# EAGLE design counter-defender-featherwing-mk-2.0 (EAGLE 7.5.0)
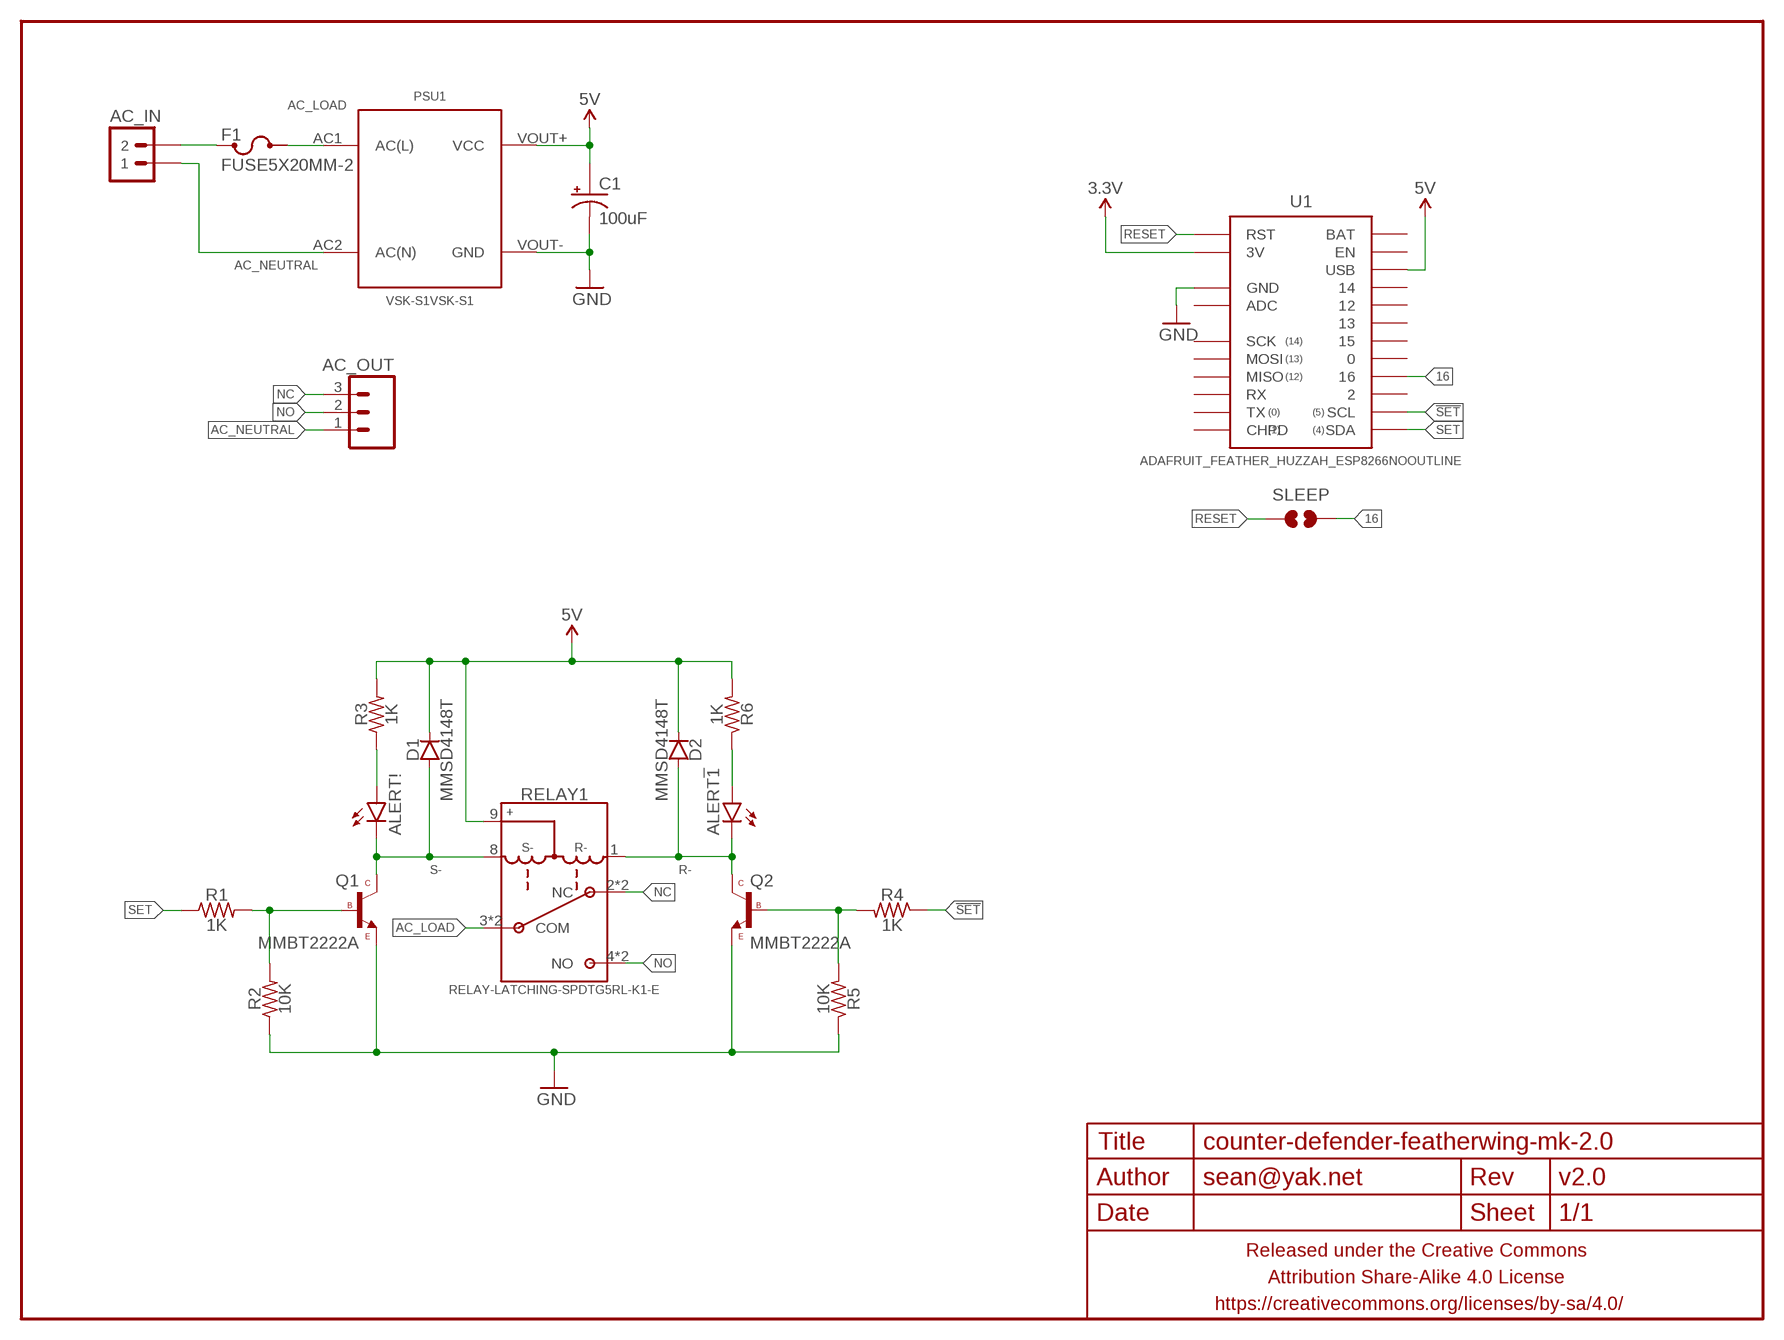
[diagram p0: schematic, sheet 1]

## Parts
AC_IN  M023.5MM  [SCREWTERMINAL-3.5MM-2]
AC_OUT  M03SCREW  [SCREWTERMINAL-3.5MM-3]
ALERT!  LED0603-TIGHT  [LED-0603-TIGHT]
ALERT!1  LED0603-TIGHT  [LED-0603-TIGHT]
C1  100uF  CAPACITOR-POLARIZEDE2.5-6  [E2,5-6]
D1  MMSD4148T  DIODESOD123  [SOD123]
D2  MMSD4148T  DIODESOD123  [SOD123]
F1  FUSE5X20MM-2  [FUSE-2AG]
FRAME1  FRAME-LETTERNO_PACKAGE  [DUMMY]
PSU1  VSK-S1VSK-S1  [VSK-S1]
Q1  MMBT2222A  TRANSISTOR_NPNMMBT2222A  [SOT23]
Q2  MMBT2222A  TRANSISTOR_NPNMMBT2222A  [SOT23]
R1  1K  RESISTORR0603-TIGHTER  [R0603-TIGHTER]
R2  10K  RESISTORR0603-TIGHTER  [R0603-TIGHTER]
R3  1K  RESISTORR0603-TIGHTER  [R0603-TIGHTER]
R4  1K  RESISTORR0603-TIGHTER  [R0603-TIGHTER]
R5  10K  RESISTORR0603-TIGHTER  [R0603-TIGHTER]
R6  1K  RESISTORR0603-TIGHTER  [R0603-TIGHTER]
RELAY1  RELAY-LATCHING-SPDTG5RL-K1-E  [G5RL-K1-E]
SLEEP  JUMPER-PAD-2-NOYES_SILK  [PAD-JUMPER-2-NO_YES_SILK]
U1  ADAFRUIT_FEATHER_HUZZAH_ESP8266NOOUTLINE  [ADAFRUIT_FEATHER_HUZZAH_NOOUTLINE]

## Nets
3.3V: U1.3V
5V: C1.+ D1.C D2.C PSU1.VOUT+(VCC) R3.2 R6.2 RELAY1.9(+) U1.USB
16: SLEEP.2 U1.16
!SET: R4.1 U1.SCL
AC_LOAD: F1.2 F1.2@2 PSU1.AC1(AC(L)) RELAY1.3(COM) RELAY1.6(COM)
AC_NEUTRAL: AC_IN.1 AC_OUT.1
GND: C1.- PSU1.VOUT-(GND) Q1.2(E) Q2.2(E) R2.1 R5.1 U1.GND@0(GND)
N$1: ALERT!.A R3.1
N$2: Q1.1(B) R1.2 R2.2
N$3: Q2.1(B) R4.2 R5.2
N$4: ALERT!1.A R6.1
N$6: AC_IN.2 F1.1 F1.1@1
NC: AC_OUT.3 RELAY1.2(NC) RELAY1.7(NC)
NO: AC_OUT.2 RELAY1.4(NO) RELAY1.5(NO)
R-: ALERT!1.C D2.A Q2.3(C) RELAY1.1(R-)
RESET: SLEEP.1 U1.RST
S-: ALERT!.C D1.A Q1.3(C) RELAY1.8(S-)
SET: R1.1 U1.SDA
Unconnected: PSU1.AC2(AC(N)) U1.0 U1.2 U1.12 U1.13 U1.14 U1.15 U1.ADC U1.BAT U1.CHPD U1.EN U1.MISO U1.MOSI U1.RX U1.SCK U1.TX

## Library data of the parts
AC_IN = a_parts:M02: Standard 2-pin 0.1" header. Use with - straight break away headers ( PRT-00116) - right angle break away headers (PRT-00553) - swiss pins (PRT-00743) - machine pins (PRT-00117) - female headers (PRT-00115) Molex polarized connector foot print use with: PRT-08233 with associated crimp pins and housings. 2.54_SCREWTERM for use with PRT-10571. 3.5mm Screw Terminal footprints for PRT-08084 5mm Screw Terminal footprints for use with PRT-08433
AC_OUT = a_parts:M03: Header 3 Standard 3-pin 0.1" header. Use with straight break away headers (SKU : PRT-00116), right angle break away headers (PRT-00553), swiss pins (PRT-00743), machine pins (PRT-00117), and female headers (PRT-00115). Molex polarized connector foot print use with SKU : PRT-08232 with associated crimp pins and housings.
ALERT! ALERT!1 = a_parts:LED: LEDs Standard schematic elements and footprints for 5mm, 3mm, 1206, and 0603 sized LEDs. 5mm - Spark Fun Electronics SKU : COM-00529 (and others)
C1 = a_parts:CAPACITOR-POLARIZED: POLARIZED CAPACITOR, American symbol
D1 D2 = a_parts:DIODE: Diode These are standard reverse protection diodes and small signal diodes. SMA package can handle up to about 1A. SOD-323 can handle about 200mA. What the SOD-323 package when ordering, there are some mfgs out there that are 5-pin packages.
F1 = a_parts:FUSE
FRAME1 = a_parts:FRAME-LETTER: Schematic Frame Standard 8.5x11 US Letter frame; DESIGNER: sean@yak.net; VERSION: v2.0
PSU1 = a_parts:VSK-S1: VSK-S1 is an AC/DC converter for PCB mounting.
Q1 Q2 = a_parts:TRANSISTOR_NPN: Generic NPN BJT MMBT2222A - TRANS-08049 (SOT-23, 1A 40V) MPSA42 - TRANS-09116 (SOT-23, 500mA 300V) MMBT5088LT1G - TRANS-11160 (SOT-23, 50 mA 30V) BC547 - COM-08928 <http://www.sparkfun.com/products/8928> (TO-92 45V 100mA) (1.Collector 2.Base 3.Emitter) 2N3904 - COM-00521 <http://www.sparkfun.com/products/521> (TO-92 40V 200mA) (1.Emitter 2.Base 3.Collector) P2N2222A - COM-12852 <http://www.sparkfun.com/products/12852> (TO-92 40V 600mA) (1.Collector 2.Base 3.Emitter)
R1-R6 = a_parts:RESISTOR: RESISTOR, American symbol
RELAY1 = a_parts:RELAY-LATCHING-SPDT
SLEEP = a_parts:JUMPER-PAD-2-NO
U1 = a_parts:ADAFRUIT_FEATHER_HUZZAH_ESP8266

## Board
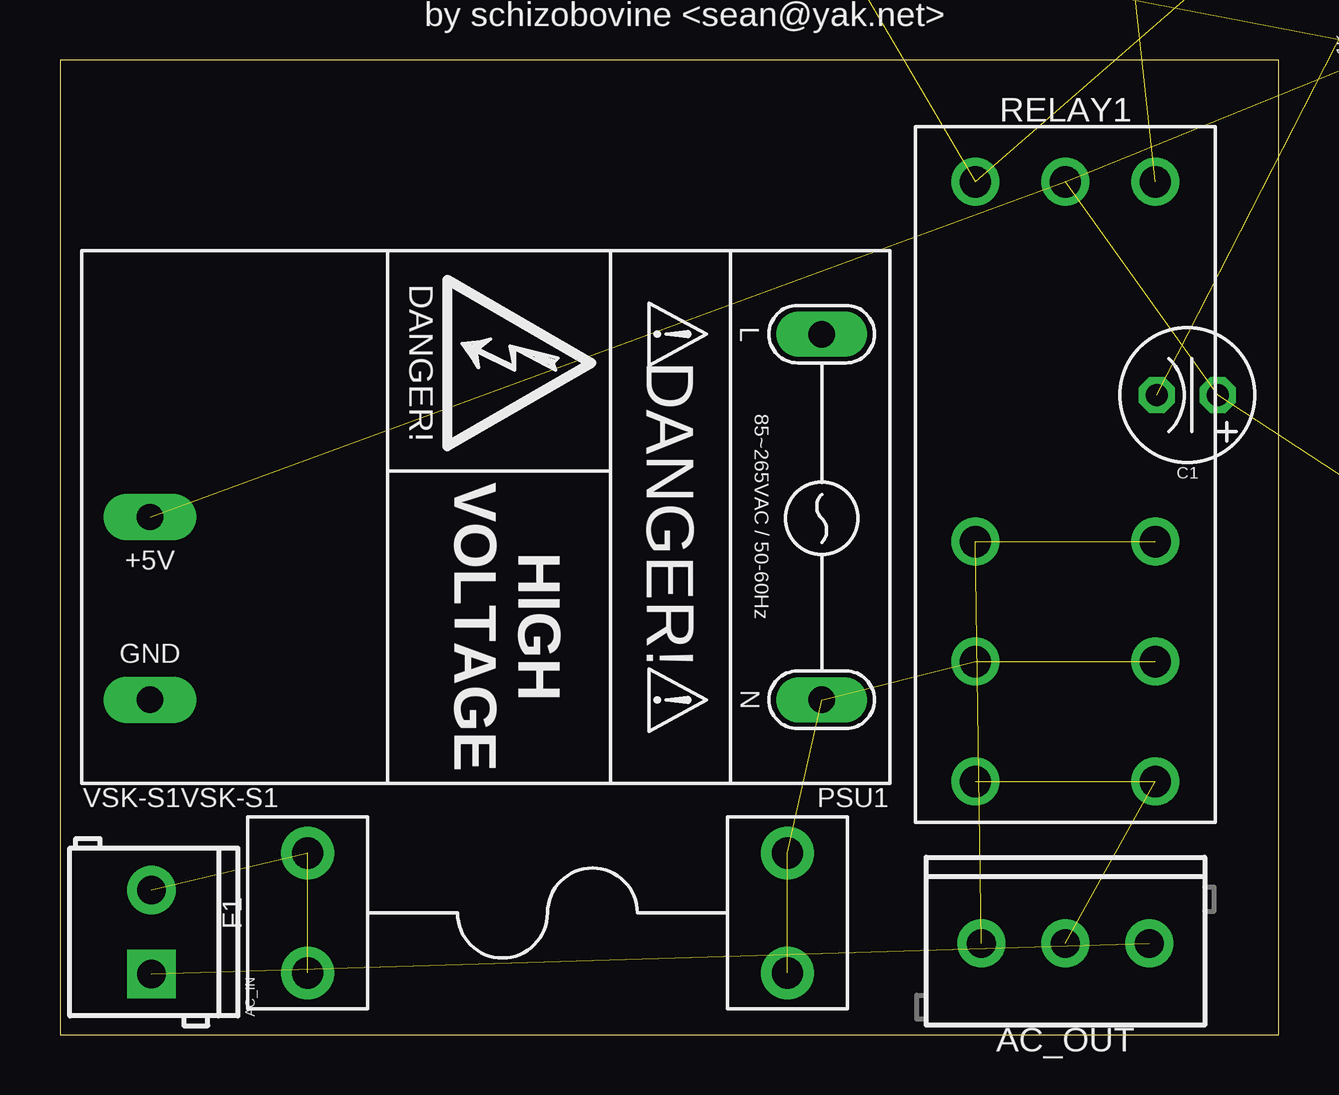
[diagram p1: board, top side]
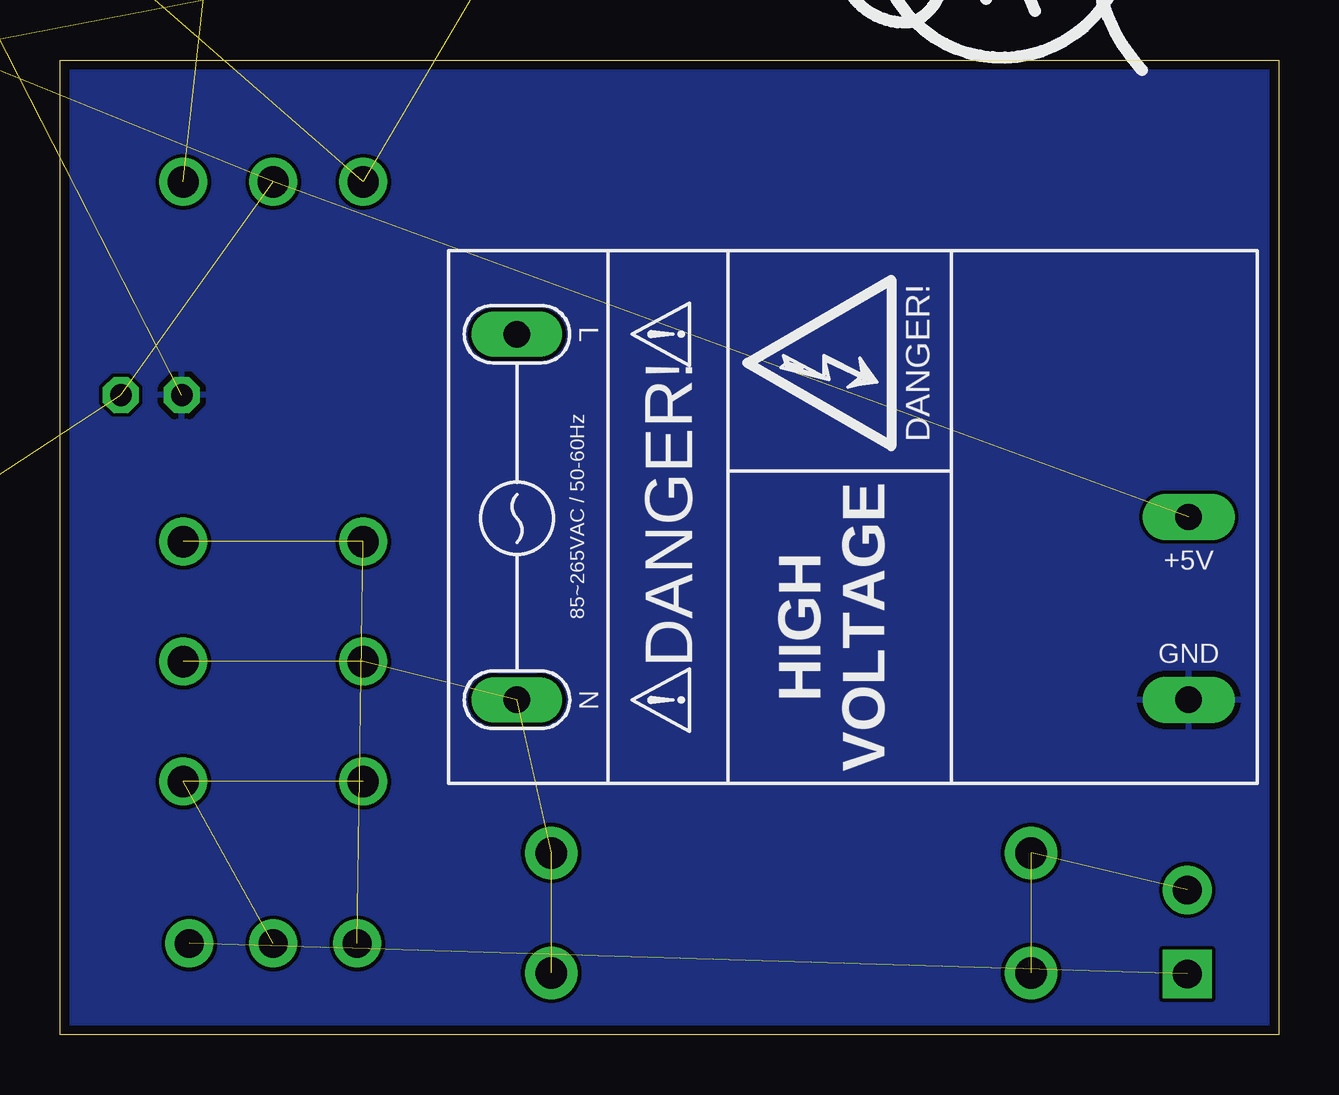
[diagram p2: board, bottom side, seen from below]

Size 50.8 x 40.64 mm. Coordinates in mm from the lower left corner, seen from the top.
Outline: 0,40.64 0,0 50.8,0 50.8,40.64 0,40.64
Copper layers (1*16): Top 0.0356mm / dielectric 1.5011mm / Bottom 0.0356mm
Design rules "LaenPCBOrder2": minimum track width 6mil, minimum drill 13mil, track to track 6mil, track to pad 6mil, pad to pad 6mil, via to via 6mil, smd to smd 6mil, copper to edge 15mil, drill to drill 6mil, minimum pad ring 7mil, minimum via ring 7mil, stop-mask expansion 3mil, vias tented up to drill 20mil, thermal gap 10mil

### Footprints (pad centres in the part's own frame; a part is rotated, then mirrored left to right if it is on the bottom)
SCREWTERMINAL-3.5MM-2 = drill 1.2 pad 2.032 square: 1 0,0 | drill 1.2 pad 2.032: 2 3.5,0
SCREWTERMINAL-3.5MM-3 = drill 1.2 pad 2: 1 -3.5,0; 2 0,0; 3 3.5,0
LED-0603-TIGHT = smd 0.8 x 1.1: A 0.75,0; C -0.75,0
E2,5-6 = drill 0.9 pad 1.5 octagon: + -1.27,0; - 1.27,0
SOD123 = smd 1.2 x 1: A -1.8,0; C 1.8,0
FUSE-2AG = drill 1.3 pad 2.2: 1 -10,2.5; 1@1 -10,-2.5; 2 10,2.5; 2@2 10,-2.5
VSK-S1 = drill 1.1 pad 1.9 long: AC1 0,15.24; AC2 0,0 | drill 1.1 pad 1.93 long: VOUT+ 28,7.62; VOUT- 28,15.24
SOT23 = smd 1 x 1.2: 1 -0.95,-1; 2 0.95,-1; 3 0,1
R0603-TIGHTER = smd 0.8 x 1.1: 1 -0.75,0; 2 0.75,0
G5RL-K1-E = drill 1.3 pad 2: 1 0,3.75; 2 15,3.75; 3 20,3.75; 4 25,3.75; 5 25,-3.75; 6 20,-3.75; 7 15,-3.75; 8 0,-3.75; 9 0,0
PAD-JUMPER-2-NO_YES_SILK = smd 0.635 x 1.27: 1 -0.45,0; 2 0.45,0
ADAFRUIT_FEATHER_HUZZAH_NOOUTLINE = drill 1 pad 1.5 octagon: 0 8.89,10.16; 2 13.97,10.16; 3V -16.51,-10.16; 12 1.27,10.16; 13 3.81,10.16; 14 -1.27,10.16; 15 6.35,10.16; 16 11.43,10.16; ADC -8.89,-10.16; BAT -8.89,10.16; CHPD 19.05,-10.16; EN -6.35,10.16; GND@0 -11.43,-10.16; MISO 11.43,-10.16; MOSI 8.89,-10.16; NC@3 -13.97,-10.16; NC@6 -6.35,-10.16; NC@7 -3.81,-10.16; NC@8 -1.27,-10.16; NC@9 1.27,-10.16; NC@10 3.81,-10.16; RST -19.05,-10.16; RX 13.97,-10.16; SCK 6.35,-10.16; SCL 16.51,10.16; SDA 19.05,10.16; TX 16.51,-10.16; USB -3.81,10.16

### Placement (x,y rotation side)
AC_IN  3.81,2.54 90 top
AC_OUT  41.91,3.81 180 top
ALERT!  25.4,47.62 270 top  (outside the outline)
ALERT!1  45.09,47.62 0 top  (outside the outline)
C1  46.99,26.67 180 top
D1  55.24,48.9 0 top  (outside the outline)
D2  64.77,48.9 0 top  (outside the outline)
F1  20.32,5.08 0 top
FRAME1  0,0 0 top
PSU1  31.75,29.21 180 top
Q1  30.48,47.62 0 top  (outside the outline)
Q2  39.37,47.62 0 top  (outside the outline)
R1  55.24,46.35 0 top  (outside the outline)
R2  55.24,43.81 0 top  (outside the outline)
R3  55.24,41.27 0 top  (outside the outline)
R4  64.14,45.09 0 top  (outside the outline)
R5  69.22,45.09 0 top  (outside the outline)
R6  64.14,42.55 0 top  (outside the outline)
RELAY1  41.91,35.56 270 top
SLEEP  78.11,21.59 90 bottom  (outside the outline)
U1  74.93,19.68 90 top  (outside the outline)
U$1  [COW]  12.7,45.72 270 bottom  (outside the outline)

### Tracks (layer width: path | path; a pad name or v marks a point on that pad's centre or on a via)
5V  (7 unrouted)
16  (1 unrouted)
!SET  (1 unrouted)
AC_LOAD  (4 unrouted)
AC_NEUTRAL  (1 unrouted)
GND  (5 unrouted)
  pour Bottom: 50.8,0 0,0 0,40.64 50.8,40.64
N$1  (1 unrouted)
N$2  (2 unrouted)
N$3  (2 unrouted)
N$4  (1 unrouted)
N$6  (2 unrouted)
NC  (2 unrouted)
NO  (2 unrouted)
R-  (3 unrouted)
RESET  (1 unrouted)
S-  (3 unrouted)
SET  (1 unrouted)

### Text on the board
tPlace: Counter Defender / Featherwing | by schizobovine <sean@yak.net>